# Altium schematic sheet MCU_Breakout.SchDoc
size C
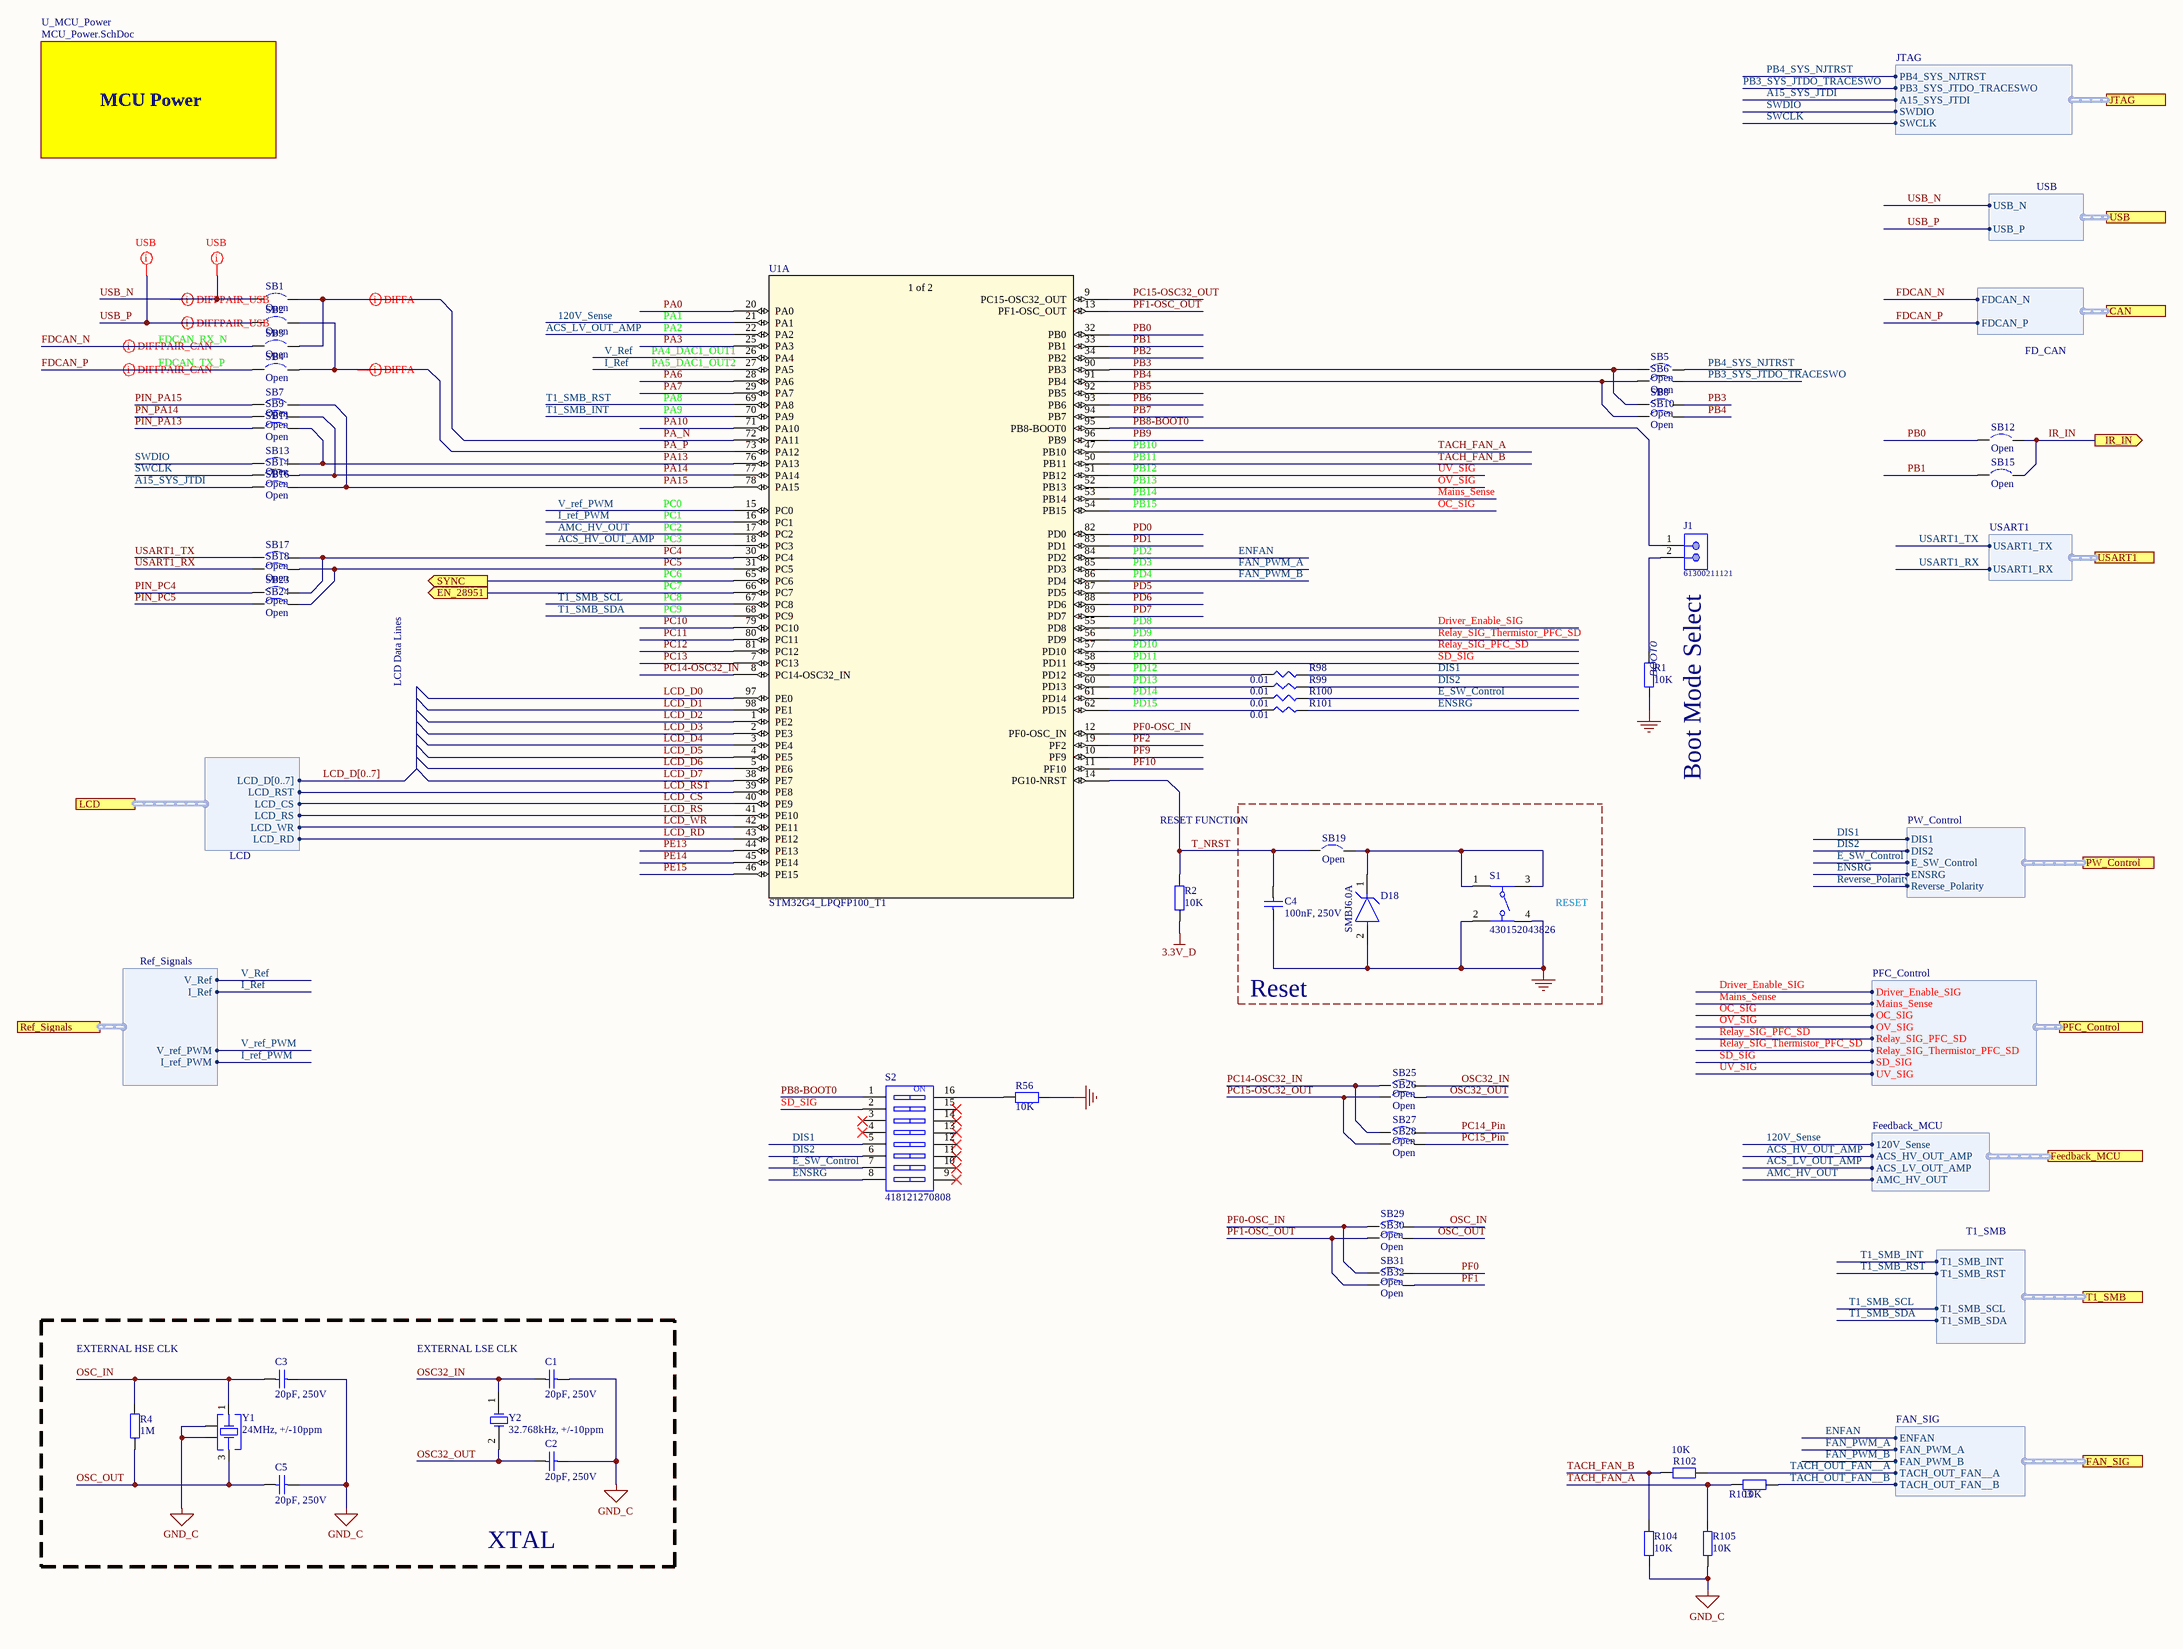
[diagram p0: MCU_Breakout.SchDoc]

## Parts
C1  20pF, 250V  [WCAP-CSMH_0603_Reflow]
C2  20pF, 250V  [WCAP-CSMH_0603_Reflow]
C3  20pF, 250V  [WCAP-CSMH_0603_Reflow]
C4  100nF, 250V  [WCAP-CSMH_0603_Reflow]
C5  20pF, 250V  [WCAP-CSMH_0603_Reflow]
D18  SMBJ6.0A  [FP-SMBJ-MFG]
J1  61300211121  [61300211121]
R1  10K  [WRIS-KSKE_0603_H=0.45mm]
R2  10K  [WRIS-KSKE_0603_H=0.45mm]
R4  1M  [WRIS-KSKE_0603_H=0.45mm]
R56  10K  [WRIS-KSKE_0603_H=0.45mm]
R98  0.01  [SMD-0603-RES]
R99  0.01  [SMD-0603-RES]
R100  0.01  [SMD-0603-RES]
R101  0.01  [SMD-0603-RES]
R102  10K  [WRIS-KSKE_0603_H=0.45mm]
R103  10K  [WRIS-KSKE_0603_H=0.45mm]
R104  10K  [WRIS-KSKE_0603_H=0.45mm]
R105  10K  [WRIS-KSKE_0603_H=0.45mm]
S1  430152043826  [430152043826]
S2  418121270808  [418121270808]
SB1  Open  [SB_0603]  (no BOM)
SB2  Open  [SB_0603]  (no BOM)
SB3  Open  [SB_0603]  (no BOM)
SB4  Open  [SB_0603]  (no BOM)
SB5  Open  [SB_0603]  (no BOM)
SB6  Open  [SB_0603]  (no BOM)
SB7  Open  [SB_0603]  (no BOM)
SB8  Open  [SB_0603]  (no BOM)
SB9  Open  [SB_0603]  (no BOM)
SB10  Open  [SB_0603]  (no BOM)
SB11  Open  [SB_0603]  (no BOM)
SB12  Open  [SB_0603]  (no BOM)
SB13  Open  [SB_0603]  (no BOM)
SB14  Open  [SB_0603]  (no BOM)
SB15  Open  [SB_0603]  (no BOM)
SB16  Open  [SB_0603]  (no BOM)
SB17  Open  [SB_0603]  (no BOM)
SB18  Open  [SB_0603]  (no BOM)
SB19  Open  [SB_0603]  (no BOM)
SB23  Open  [SB_0603]  (no BOM)
SB24  Open  [SB_0603]  (no BOM)
SB25  Open  [SB_0603]  (no BOM)
SB26  Open  [SB_0603]  (no BOM)
SB27  Open  [SB_0603]  (no BOM)
SB28  Open  [SB_0603]  (no BOM)
SB29  Open  [SB_0603]  (no BOM)
SB30  Open  [SB_0603]  (no BOM)
SB31  Open  [SB_0603]  (no BOM)
SB32  Open  [SB_0603]  (no BOM)
U1  STM32G4_LPQFP100_T1  [TSQFP50P1600X1600X160-100N]  (part A of 2)
Y1  24MHz, +/-10ppm  [WE-XTAL_CFPX-180]
Y2  32.768kHz, +/-10ppm  [WE-XTAL_IQXC-25]

## Blocks framed on the sheet
Reset: C4 D18 S1 SB19
XTAL: C1-C3 C5 R4 Y1 Y2

## Sub-sheets
U_MCU_Power = MCU_Power.SchDoc: no entries

## Ports
CAN (harness FD_CAN), EN_28951 (out), FAN_SIG (harness FAN_SIG), Feedback_MCU (harness Feedback_MCU), IR_IN (out), JTAG (harness JTAG), LCD (harness LCD), PFC_Control (harness PFC_Control), PW_Control (harness PW_Control), Ref_Signals (harness Ref_Signals), SYNC (out), T1_SMB (harness T1_SMB), USART1 (harness USART1), USB (harness USB)

## Harnesses
JTAG: PB3_SYS_JTDO_TRACESWO, PB4_SYS_NJTRST, SWDIO, SWCLK, A15_SYS_JTDI
USB: USB_N, USB_P
FD_CAN: FDCAN_N, FDCAN_P
LCD: LCD_RST, LCD_CS, LCD_RS, LCD_D[0..7], LCD_WR, LCD_RD
USART1: USART1_TX, USART1_RX
T1_SMB: T1_SMB_INT, T1_SMB_RST, T1_SMB_SCL, T1_SMB_SDA
Feedback_MCU: 120V_Sense, ACS_HV_OUT_AMP, ACS_LV_OUT_AMP, AMC_HV_OUT
PFC_Control: Driver_Enable_SIG, Mains_Sense, OC_SIG, OV_SIG, Relay_SIG_PFC_SD, Relay_SIG_Thermistor_PFC_SD, SD_SIG, UV_SIG
PW_Control: DIS1, DIS2, E_SW_Control, ENSRG, Reverse_Polarity
Ref_Signals: V_Ref, I_Ref, V_ref_PWM, I_ref_PWM
FAN_SIG: ENFAN, FAN_PWM_A, FAN_PWM_B, TACH_OUT_FAN__A, TACH_OUT_FAN__B

## Nets
3.3V_D: R2.1
GND: C4.1 D18.2(A) R1.1 R56.1 S1.2 S1.4
GND_C: C1.2 C2.2 C3.2 C5.2 R104.2 R105.2 Y1.2(GND) Y1.4(GND)
120V_Sense: U1.21(PA1) ; port Feedback_MCU.120V_Sense
A15_SYS_JTDI: SB16.2 ; port JTAG.A15_SYS_JTDI
ACS_HV_OUT_AMP: U1.18(PC3) ; port Feedback_MCU.ACS_HV_OUT_AMP
ACS_LV_OUT_AMP: U1.22(PA2) ; port Feedback_MCU.ACS_LV_OUT_AMP
AMC_HV_OUT: U1.17(PC2) ; port Feedback_MCU.AMC_HV_OUT
DIS1: R98.2 S2.5 ; port PW_Control.DIS1
DIS2: R99.2 S2.6 ; port PW_Control.DIS2
Driver_Enable_SIG: U1.55(PD8) ; port PFC_Control.Driver_Enable_SIG
E_SW_Control: R100.2 S2.7 ; port PW_Control.E_SW_Control
EN_28951: U1.66(PC7) ; port EN_28951
ENFAN: U1.84(PD2) ; port FAN_SIG.ENFAN
ENSRG: R101.2 S2.8 ; port PW_Control.ENSRG
FAN_PWM_A: U1.85(PD3) ; port FAN_SIG.FAN_PWM_A
FAN_PWM_B: U1.86(PD4) ; port FAN_SIG.FAN_PWM_B
FDCAN_N: SB3.1 ; port CAN.FDCAN_N
FDCAN_P: SB4.1 ; port CAN.FDCAN_P
I_Ref: U1.27(PA5) ; port Ref_Signals.I_Ref
I_ref_PWM: U1.16(PC1) ; port Ref_Signals.I_ref_PWM
IR_IN: SB12.1 SB15.1 ; port IR_IN
LCD_CS: U1.40(PE9) ; port LCD.LCD_CS
LCD_D0: U1.97(PE0)
LCD_D1: U1.98(PE1)
LCD_D2: U1.1(PE2)
LCD_D3: U1.2(PE3)
LCD_D4: U1.3(PE4)
LCD_D5: U1.4(PE5)
LCD_D6: U1.5(PE6)
LCD_D7: U1.38(PE7)
LCD_RD: U1.43(PE12) ; port LCD.LCD_RD
LCD_RS: U1.41(PE10) ; port LCD.LCD_RS
LCD_RST: U1.39(PE8) ; port LCD.LCD_RST
LCD_WR: U1.42(PE11) ; port LCD.LCD_WR
Mains_Sense: U1.53(PB14) ; port PFC_Control.Mains_Sense
OC_SIG: U1.54(PB15) ; port PFC_Control.OC_SIG
OSC32_IN: C1.1 SB25.1 Y2.1(OSC1)
OSC32_OUT: C2.1 SB26.1 Y2.2(OSC2)
OSC_IN: C3.1 R4.2 SB29.1 Y1.1(Crystal)
OSC_OUT: C5.1 R4.1 SB30.1 Y1.3(Crystal)
OV_SIG: U1.52(PB13) ; port PFC_Control.OV_SIG
PA0: U1.20(PA0)
PA3: U1.25(PA3)
PA6: U1.28(PA6)
PA7: U1.29(PA7)
PA10: U1.71(PA10)
PA13: SB11.1 SB13.1 U1.76(PA13)
PA14: SB9.1 SB14.1 U1.77(PA14)
PA15: SB7.1 SB16.1 U1.78(PA15)
PA_N: SB1.2 SB3.2 U1.72(PA11)
PA_P: SB2.2 SB4.2 U1.73(PA12)
PB0: SB12.2 U1.32(PB0)
PB1: SB15.2 U1.33(PB1)
PB2: U1.34(PB2)
PB3: SB5.2 SB8.1 SB8.2 U1.90(PB3)
PB3_SYS_JTDO_TRACESWO: SB6.1 ; port JTAG.PB3_SYS_JTDO_TRACESWO
PB4: SB6.2 SB10.1 SB10.2 U1.91(PB4)
PB4_SYS_NJTRST: SB5.1 ; port JTAG.PB4_SYS_NJTRST
PB5: U1.92(PB5)
PB6: U1.93(PB6)
PB7: U1.94(PB7)
PB8-BOOT0: J1.1 S2.1 U1.95(PB8-BOOT0)
PB9: U1.96(PB9)
PC4: SB17.1 SB23.1 U1.30(PC4)
PC5: SB18.1 SB24.1 U1.31(PC5)
PC10: U1.79(PC10)
PC11: U1.80(PC11)
PC12: U1.81(PC12)
PC13: U1.7(PC13)
PC14-OSC32_IN: SB25.2 SB27.2 U1.8(PC14-OSC32_IN)
PC14_Pin: SB27.1
PC15-OSC32_OUT: SB26.2 SB28.2 U1.9(PC15-OSC32_OUT)
PC15_Pin: SB28.1
PD0: U1.82(PD0)
PD1: U1.83(PD1)
PD5: U1.87(PD5)
PD6: U1.88(PD6)
PD7: U1.89(PD7)
PE13: U1.44(PE13)
PE14: U1.45(PE14)
PE15: U1.46(PE15)
PF0: SB31.1
PF0-OSC_IN: SB29.2 SB31.2 U1.12(PF0-OSC_IN)
PF1: SB32.1
PF1-OSC_OUT: SB30.2 SB32.2 U1.13(PF1-OSC_OUT)
PF2: U1.19(PF2)
PF9: U1.10(PF9)
PF10: U1.11(PF10)
PIN_PA13: SB11.2
PIN_PA15: SB7.2
PIN_PC4: SB23.2
PIN_PC5: SB24.2
PN_PA14: SB9.2
Relay_SIG_PFC_SD: U1.57(PD10) ; port PFC_Control.Relay_SIG_PFC_SD
Relay_SIG_Thermistor_PFC_SD: U1.56(PD9) ; port PFC_Control.Relay_SIG_Thermistor_PFC_SD
Reverse_Polarity: port PW_Control.Reverse_Polarity
SD_SIG: S2.2 U1.58(PD11) ; port PFC_Control.SD_SIG
SWCLK: SB14.2 ; port JTAG.SWCLK
SWDIO: SB13.2 ; port JTAG.SWDIO
SYNC: U1.65(PC6) ; port SYNC
T1_SMB_INT: U1.70(PA9) ; port T1_SMB.T1_SMB_INT
T1_SMB_RST: U1.69(PA8) ; port T1_SMB.T1_SMB_RST
T1_SMB_SCL: U1.67(PC8) ; port T1_SMB.T1_SMB_SCL
T1_SMB_SDA: U1.68(PC9) ; port T1_SMB.T1_SMB_SDA
T_NRST: C4.2 R2.2 SB19.2 U1.14(PG10-NRST)
TACH_FAN_A: R103.2 R105.1 U1.47(PB10)
TACH_FAN_B: R102.1 R104.1 U1.50(PB11)
TACH_OUT_FAN__A: R102.2 ; port FAN_SIG.TACH_OUT_FAN__A
TACH_OUT_FAN__B: R103.1 ; port FAN_SIG.TACH_OUT_FAN__B
USART1_RX: SB18.2 ; port USART1.USART1_RX
USART1_TX: SB17.2 ; port USART1.USART1_TX
USB_N: SB1.1 ; port USB.USB_N
USB_P: SB2.1 ; port USB.USB_P
UV_SIG: U1.51(PB12) ; port PFC_Control.UV_SIG
V_Ref: U1.26(PA4) ; port Ref_Signals.V_Ref
V_ref_PWM: U1.15(PC0) ; port Ref_Signals.V_ref_PWM
NetD18_1: D18.1(C) S1.1 S1.3 SB19.1
NetJ1_2: J1.2 R1.2
NetR56_2: R56.2 S2.16
NetR98_1: R98.1 U1.59(PD12)
NetR99_1: R99.1 U1.60(PD13)
NetR100_1: R100.1 U1.61(PD14)
NetR101_1: R101.1 U1.62(PD15)

Not connected (* = marked no-connect by the designer): S2 3* 4* 9* 10* 11* 12* 13* 14* 15*

## Buses and harness runs
bus LCD_D[0..7]

## Layout directives
differential pair: FDCAN_N, FDCAN_P, PA_N, PA_P
rule Undefined; rule Matched Net Lengths [Tolerance = 0.2mm]; rule Impedance Constraint [Min = 85.00    Max = 95.00    ]: USB_N, USB_P
differential pair; rule Impedance Constraint [Min = 85.00    Max = 95.00    ]: USB_N, USB_P

## Notes on the sheet
- MCU Power
- FDCAN_RX_N
- PA4_DAC1_OUT1
- PA1
- PA2
- FDCAN_TX_P
- PA5_DAC1_OUT2
- PA9
- PA8
- PB12
- PB11
- PB10
- PC0
- PC1
- PC2
- PB13
- PB14
- PB15
- PC3
- PC6
- PC7
- PD3
- PD4
- PD2
- PC9
- PC8
- PD8
- PD9
- PD10
- (near R1) BOOT0
- LCD Data Lines
- PD11
- PD12
- PD13
- PD14
- PD15
- (near SB19) RESET FUNCTION
- Boot Mode Select
- (near S1) RESET
- EXTERNAL HSE CLK
- EXTERNAL LSE CLK
- (in symbol 418121270808) ON
- (in symbol STM32G4_LPQFP100, part A) 1 of 2

## Library data of the parts
C1-C5 = 885342006002: WCAP-CSMH Ceramic Capacitors, size 0603, 33pF, 250VDC; Ceramic Type: NP0 Class I; Insulation Resistance: 10GOhm; Technical Reference: NP00603330J250DFCT10000; ComponentLink1Description: Manufacturer; ComponentLink1URL: http://www.we-online.de; ComponentLink2Description: Datasheet; ComponentLink2URL: https://katalog.we-online.com/pbs/datasheet/885342006002.pdf; Packaging: Tape and Reel; Part Number: 885342006002; Published Date: August 2019; Rated Voltage: 250VDC; Size: 0603; Mounting Technology: SMD; Publisher: Wurth Elektronik; Capacitance: 33pF; Dissipation Factor: -; Operating Temperature: -55 to +125degC
D18 = CMP-08607-000069-1: TVS DIODE 6V 10.3V DO214AA; Manufacturer: Littelfuse Inc; Breakdown Voltage: 6.67V; Direction: Unidirectional; Number Of Channels: 1; Peak Pulse Power: 600W; Peak Pulse Current: 58.3A; Max Junction Temp: +150°C; Category: Diode; ComponentLink2Description: Datasheet; Octopart: https://octopart.com/smbj6.0a-littelfuse-66100; Clamping Voltage: 10.3V; Device Class L3: unset; Temperature Range Low: -65°C; Temperature: -65°C to +150°C; ComponentLink2URL: https://www.littelfuse.com/~/media/electronics/datasheets/tvs_diodes/littelfuse_tvs_diode_smbj_datasheet.pdf.pdf; Height: 2.61mm; Digikey Description: TVS DIODE 6V 10.3V DO214AA; Manufacturer Part Number: SMBJ6.0A; Temperature Range High: +150°C; Device Class L2: TVS Diodes; Mouser Description: In a Pack of 10, Littelfuse SMBJ6.0A, Uni-Directional TVS Diode, 600W, 2-Pin DO-214AA; Automotive: No; RoHS: TRUE; Device Class L1: Circuit Protection; Reverse Standoff Voltage: 6V; Lead Free: Yes; Package: SMBJ
J1 = 61300211121: WR-PHD Pin Header, THT, pitch 2.54mm, Single Row, Vertical, 2pin; Pin Number: 2; Gender: Male; Rated Current: 3A; Working Voltage: 250VAC; Withstanding Voltage: 500VAC; Contact Resistance: 20mOhm; ComponentLink1Description: Manufacturer; ComponentLink1URL: http://www.we-online.de; ComponentLink2Description: Datasheet; ComponentLink2URL: https://katalog.we-online.de/em/datasheet/6130xx11121.pdf; Part Number: 61300211121; Published Date: June 2019; Publisher: Wurth Elektronik; Pitch: 2.54mm; Operating Temperature: -40 to +105degC; Mounting Technology: THT; Packaging: Bag; Row Number: Single; Orientation: Vertical
R1 R2 R4 R56 R102-R105 = 560050316011: WRIS-KSKE Thick Film Resistors, size 0603, 0.5Ohm, +/-1%, 0.25W; Rated Current: 0.7A; Temperature Coefficient of Resistance: +/-100ppm/degC; Technical Reference: KE0603R500F104KAATP0000; ComponentLink1Description: Manufacturer; ComponentLink1URL: http://www.we-online.de; ComponentLink2Description: Datasheet; ComponentLink2URL: https://katalog.we-online.com/pbs/datasheet/560050316011.pdf; Publisher: Wurth Elektronik; Rated Power: 0.25W; Resistance: 0.5Ohm; Mounting Technology: SMT; Height: 0.45mm; Part Number: 560050316011; Packaging: Tape and Reel; Published Date: September 2019; Size: 0603; Length: 1.6mm; Operating Temperature: -55 to +155degC; Resistance Tolerance: +/-1%; Width: 0.8mm
R98-R101 = ERJ-3LWFR010V: RES SMD 0.01 OHM 1% 1/4W 0603; Manufacturer: Panasonic Electronic Components; Factory Stock: 0; Unit Price (USD): 0.09082; @ qty: 1500; Minimum Quantity: 1; Power (Watts): 0.25W, 1/4W; Temperature Coefficient: 0/ +300ppm/°C; Part Number: ERJ-3LWFR010V; Datasheets: https://industrial.panasonic.com/cdbs/www-data/pdf/RDA0000/AOA0000C239.pdf; Image: //media.digikey.com/Photos/Panasonic%20Photos/MFG_ERJ-P6W%20Series.jpg; Digi-Key Part Number: P19180CT-ND; Quantity Available: 105; Packaging: Cut Tape (CT); Series: ERJ; Part Status: Active; Value: 0.01; Tolerance: ±1%; Composition: Thick Film; Features: Automotive AEC-Q200, Current Sense; Operating Temperature: -55°C ~ 125°C; Package / Case: 0603 (1608 Metric); Supplier Device Package: 0603; Size / Dimension: 0.063" L x 0.031" W (1.60mm x 0.80mm); Height - Seated (Max): 0.026" (0.65mm); Number of Terminations: 2; Failure Rate: -
S1 = 430152043826: WS-TASV SMT Tact Switch 6x6mm, height 4.3mm, 260gf; Rated Voltage: 12VDC; Rated Current: 50mA; Washable: No; ComponentLink1Description: Manufacturer; ComponentLink1URL: http://www.we-online.de; ComponentLink2Description: Datasheet; ComponentLink2URL: https://katalog.we-online.com/em/datasheet/430152043826.pdf; Operating Temperature: -40 to +85degC; Part Number: 430152043826; Published Date: September 2019; Contact Material: Stainless Steel; Height: 4.3mm; Mounting Technology: SMT; Contact Plating: Silver; Operation Force: 260gf; Packaging: Tape and Reel; Terminal Material: Copper Alloy; Publisher: Wurth Elektronik; Terminal Plating: Silver
S2 = 418121270808: WS-DISV Small Compact SMT Dip Switch, Raised Actuator, pitch 2.54mm, 8p; Operation Force: 600g; Pole Number: 8; Actuator Type: Raise Type; Circuit: SPST-NO; Rated Current Switching: 25mA; Rated Current Non-Switching: 100mA; Rated Voltage Non-Switching: 50VDC; Rated Voltage Switching: 24VDC; ComponentLink1Description: Manufacturer; ComponentLink1URL: http://www.we-online.de; ComponentLink2Description: Datasheet; ComponentLink2URL: https://katalog.we-online.com/em/datasheet/418121270808.pdf; Pitch: 2.54mm; Contact Material: Copper Alloy; Mounting Technology: SMT; Operating Temperature: -40 to +85degC; Contact Plating: Gold; Packaging: Tape and Reel; Part Number: 418121270808; Publisher: Wurth Elektronik; Published Date: September 2019
SB1-SB19 SB23-SB32 = Solder Bridge: Circuit Breaker; Published: 24-Mar-1999; Revision: July-2002: Re-released for DXP Platform.; Publisher: Altium Limited
U1 = STM32G4_LPQFP100: No Description Available; Vendor: STMicroelectronics; Built_By: EMA_Jessica; Manufacturer_Part_Number: STM32G4_LPQFP100_T1; Copyright: Copyright (C) 2016 Accelerated Designs. All rights reserved; RefDes: RefDes; Type: DEV
Y1 = 830058149: WE-XTAL Quartz Crystal, SMT, CFPX-180, 24MHz, +/-10ppm; Load Capacitance: 10pF; ComponentLink1Description: Manufacturer; ComponentLink1URL: http://www.we-online.de; ComponentLink2Description: Datasheet; ComponentLink2URL: https://katalog.we-online.com/pbs/datasheet/830058149.pdf; Operating Temperature: -20 to +70degC; Packaging: Tape and Reel; Part Number: 830058149; Published Date: November 2019; Size: CFPX-180; Frequency Stability: +/-10ppm; Frequency: 24MHz; Frequency Tolerance: +/-10ppm; Mounting Technology: SMT; Publisher: Wurth Elektronik
Y2 = 830062558: WE-XTAL Watch Crystal, SMT, IQXC-25, 32.768kHz, +/-10ppm; Load Capacitance: 9pF; ComponentLink1Description: Manufacturer; ComponentLink1URL: http://www.we-online.de; ComponentLink2Description: Datasheet; ComponentLink2URL: https://katalog.we-online.com/pbs/datasheet/830062558.pdf; Operating Temperature: -40 to +85degC; Packaging: Tape and Reel; Part Number: 830062558; Published Date: November 2019; Size: IQXC-25; Frequency Stability: -; Frequency: 32.768kHz; Frequency Tolerance: +/-10ppm; Mounting Technology: SMT; Publisher: Wurth Elektronik